# EAGLE design RGBLedDimmer (EAGLE 6.4)
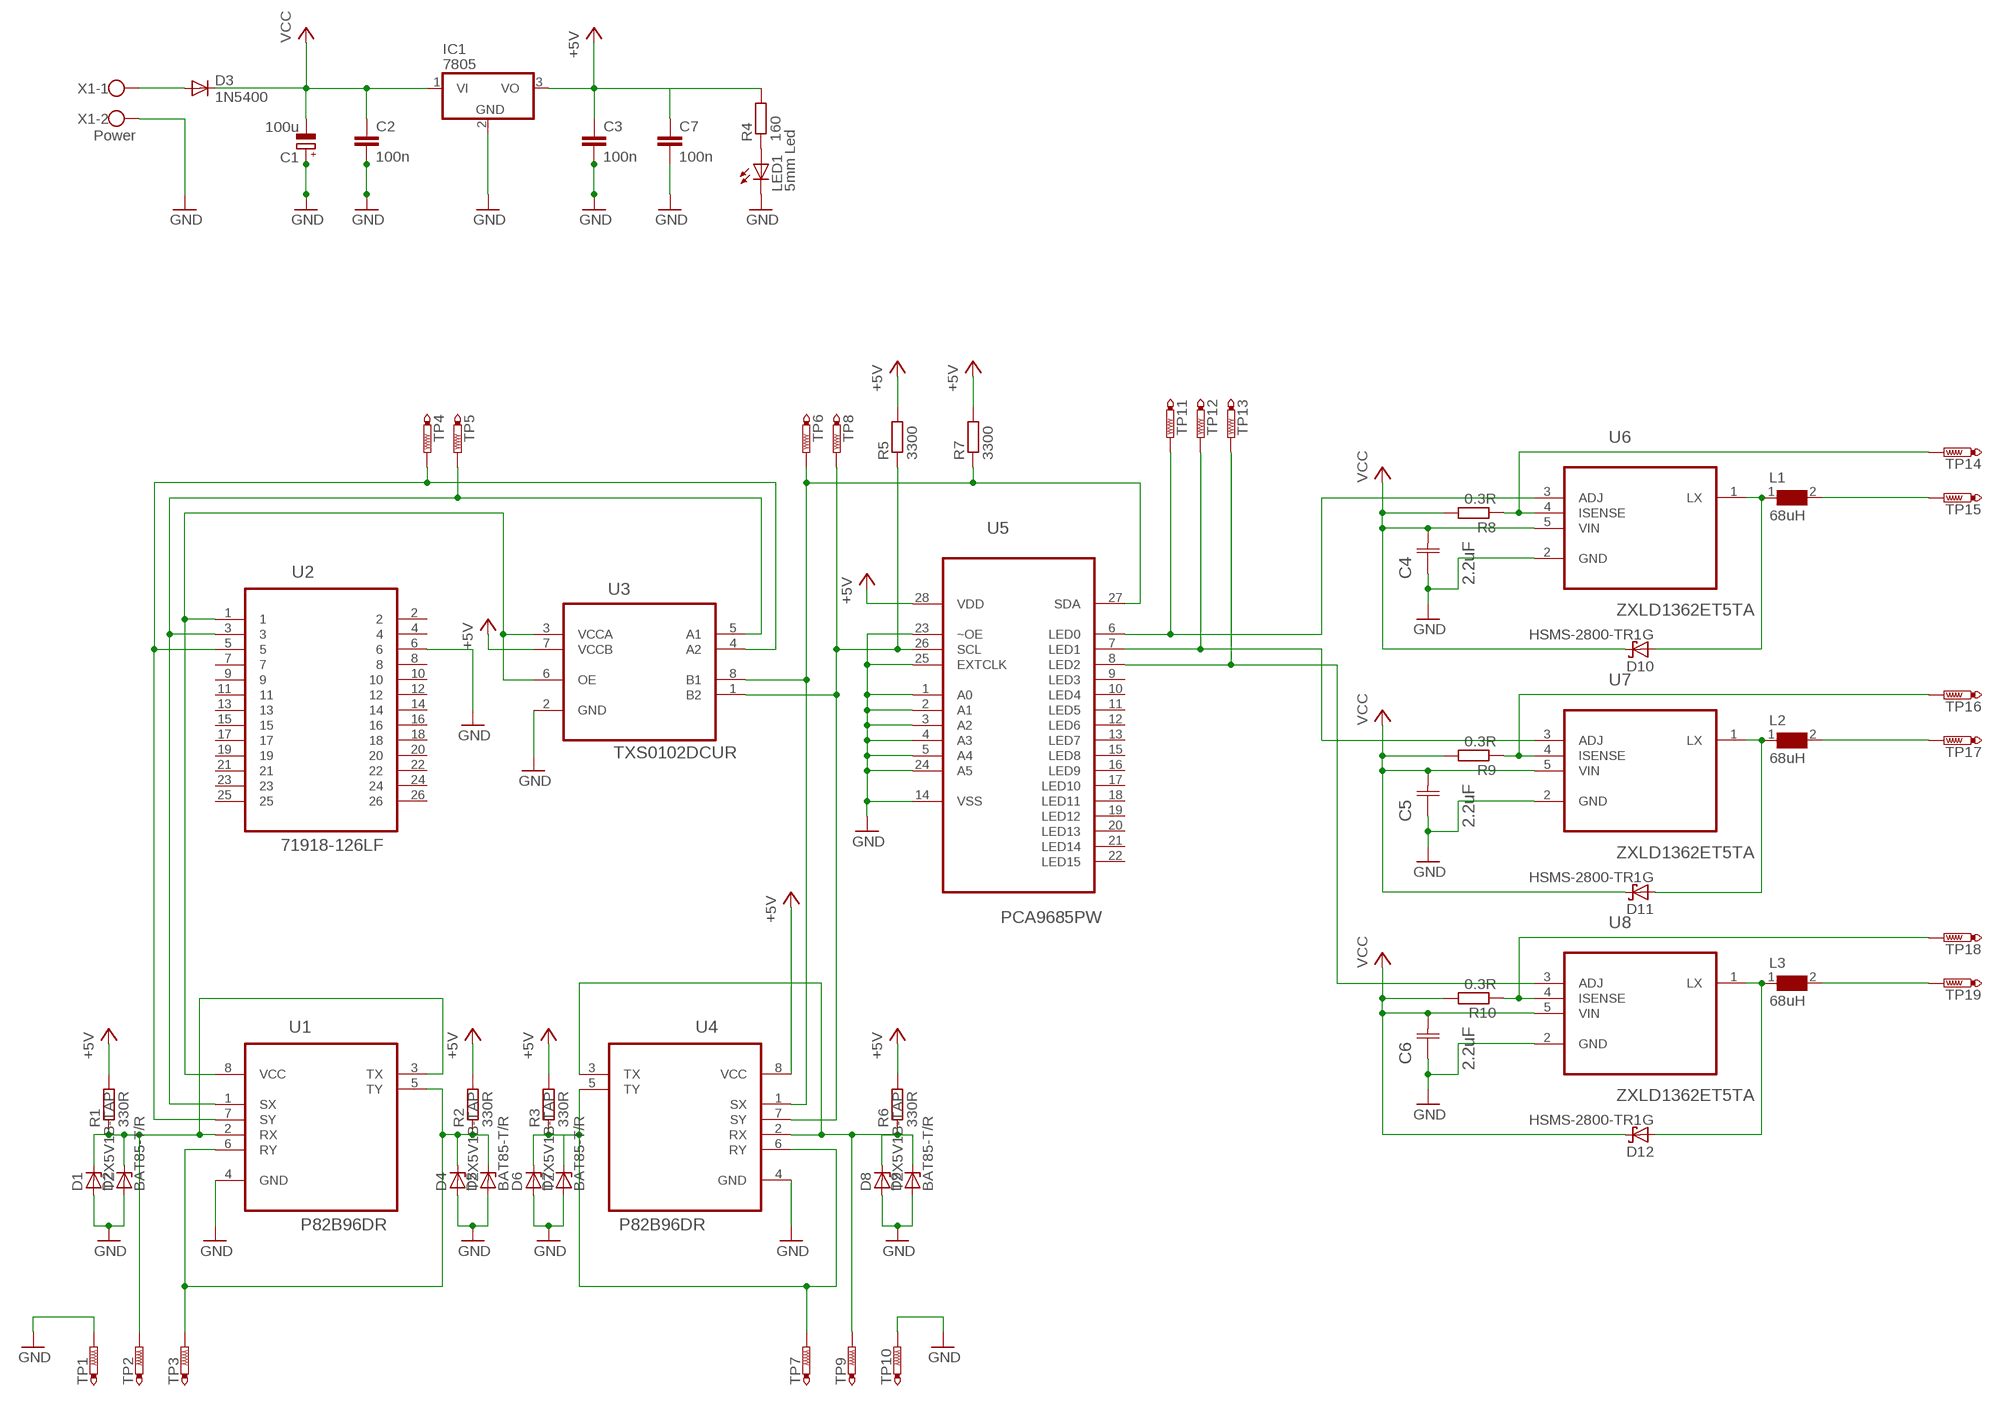
[diagram p0: schematic, sheet 1]

## Parts
C1  100u  CPOL-EUE3.5-8  [E3,5-8]
C2  100n  C-EU025_050-025X075  [C025_050-025X075]
C3  100n  C-EU025_050-025X075  [C025_050-025X075]
C4  2.2uF  08053C225KAT2A  [CAPC2013X152N]
C5  2.2uF  08053C225KAT2A  [CAPC2013X152N]
C6  2.2uF  08053C225KAT2A  [CAPC2013X152N]
C7  100n  C-EU025_050-025X075  [C025_050-025X075]
D1  TZX5V1B-TAP  ZENER-DIODEDO34-7  [DO34Z7]
D2  BAT85-T/R  ZENER-DIODEDO34-7  [DO34Z7]
D3  1N5400  [DO201-15]
D4  TZX5V1B-TAP  ZENER-DIODEDO34-7  [DO34Z7]
D5  BAT85-T/R  ZENER-DIODEDO34-7  [DO34Z7]
D6  TZX5V1B-TAP  ZENER-DIODEDO34-7  [DO34Z7]
D7  BAT85-T/R  ZENER-DIODEDO34-7  [DO34Z7]
D8  TZX5V1B-TAP  ZENER-DIODEDO34-7  [DO34Z7]
D9  BAT85-T/R  ZENER-DIODEDO34-7  [DO34Z7]
D10  HSMS-2800-TR1G  BAS70  [SOT23]
D11  HSMS-2800-TR1G  BAS70  [SOT23]
D12  HSMS-2800-TR1G  BAS70  [SOT23]
IC1  7805  7812TV  [TO220V]
L1  68uH  WE-PD4-74456168_L  [L]
L2  68uH  WE-PD4-74456168_L  [L]
L3  68uH  WE-PD4-74456168_L  [L]
LED1  5mm Led  LED5MM  [LED5MM]
R1  330R  R-EU_0204/7  [0204/7]
R2  330R  R-EU_0204/7  [0204/7]
R3  330R  R-EU_0204/7  [0204/7]
R4  160  R-EU_0204/7  [0204/7]
R5  3300  R-EU_0204/7  [0204/7]
R6  330R  R-EU_0204/7  [0204/7]
R7  3300  R-EU_0204/7  [0204/7]
R8  0.3R  R-EU_R0603  [R0603]
R9  0.3R  R-EU_R0603  [R0603]
R10  0.3R  R-EU_R0603  [R0603]
TP1  PTR1PAD1-13  [P1-13]
TP2  PTR1PAD1-13  [P1-13]
TP3  PTR1PAD1-13  [P1-13]
TP4  PTR1PAD1-13  [P1-13]
TP5  PTR1PAD1-13  [P1-13]
TP6  PTR1PAD1-13  [P1-13]
TP7  PTR1PAD1-13  [P1-13]
TP8  PTR1PAD1-13  [P1-13]
TP9  PTR1PAD1-13  [P1-13]
TP10  PTR1PAD1-13  [P1-13]
TP11  PTR1PAD1-13  [P1-13]
TP12  PTR1PAD1-13  [P1-13]
TP13  PTR1PAD1-13  [P1-13]
TP14  PTR1PAD1-13  [P1-13]
TP15  PTR1PAD1-13  [P1-13]
TP16  PTR1PAD1-13  [P1-13]
TP17  PTR1PAD1-13  [P1-13]
TP18  PTR1PAD1-13  [P1-13]
TP19  PTR1PAD1-13  [P1-13]
U1  P82B96DR  [SOIC127P600X175-8N]
U2  71918-126LF  [FCI_71918-126LF]
U3  TXS0102DCUR  [SOP50P310X90-8N]
U4  P82B96DR  [SOIC127P600X175-8N]
U5  PCA9685PW  [SOP65P640X110-28N]
U6  ZXLD1362ET5TA  [SOT95P270X145-5N]
U7  ZXLD1362ET5TA  [SOT95P270X145-5N]
U8  ZXLD1362ET5TA  [SOT95P270X145-5N]
X1  Power  W237-102  [W237-102]

## Nets
+5V [Normal Bcc]: C3.1 C7.1 IC1.3(VO) R1.2 R2.2 R3.2 R4.2 R5.2 R6.2 R7.2 U3.7(VCCB) U4.8(VCC) U5.28(VDD)
GND: C1.+ C2.2 C3.2 C4.1(C1) C5.1(C1) C6.1(C1) C7.2 D1.A D2.A D4.A D5.A D6.A D7.A D8.A D9.A IC1.2(GND) LED1.K(C) TP1.TP TP10.TP U1.4(GND) U2.6 U3.2(GND) U4.4(GND) U5.1(A0) U5.2(A1) U5.3(A2) U5.4(A3) U5.5(A4) U5.14(VSS) U5.23(~OE) U5.24(A5) U5.25(EXTCLK) U6.2(GND) U7.2(GND) U8.2(GND) X1.2
N$1 [LED Current]: R8.1 TP14.TP U6.4(ISENSE)
N$2: TP12.TP U5.7(LED1) U7.3(ADJ)
N$3: R7.1 TP6.TP U3.8(B1) U4.1(SX) U5.27(SDA)
N$4 [LED Current]: R9.1 TP16.TP U7.4(ISENSE)
N$5 [LED Current]: L2.2 TP17.TP
N$6 [LED Current]: L1.2 TP15.TP
N$7: U1.8(VCC) U2.1 U3.3(VCCA) U3.6(OE)
N$8: TP11.TP U5.6(LED0) U6.3(ADJ)
N$9 [LED Current]: D11.1(A) L2.1 U7.1(LX)
N$10 [LED Current]: D10.1(A) L1.1 U6.1(LX)
N$11 [Big Vcc]: D3.A X1.1
N$12: R5.1 TP8.TP U3.1(B2) U4.7(SY) U5.26(SCL)
N$13: TP5.TP U1.1(SX) U2.3 U3.5(A1)
N$14: TP4.TP U1.7(SY) U2.5 U3.4(A2)
N$15: TP13.TP U5.8(LED2) U8.3(ADJ)
N$16 [LED Current]: R10.1 TP18.TP U8.4(ISENSE)
N$17: D8.C D9.C R6.1 TP9.TP U4.2(RX) U4.3(TX)
N$18 [LED Current]: L3.2 TP19.TP
N$19 [LED Current]: D12.1(A) L3.1 U8.1(LX)
N$20: D1.C D2.C R1.1 TP2.TP U1.2(RX) U1.3(TX)
N$21: D4.C D5.C R2.1 TP3.TP U1.5(TY) U1.6(RY)
N$22: D6.C D7.C R3.1 TP7.TP U4.5(TY) U4.6(RY)
N$39: LED1.A R4.1
VCC [Big Vcc]: C1.- C2.1 C4.2(C2) C5.2(C2) C6.2(C2) D3.C D10.3(C) D11.3(C) D12.3(C) IC1.1(VI) R8.2 R9.2 R10.2 U6.5(VIN) U7.5(VIN) U8.5(VIN)
Unconnected: U2.2 U2.4 U2.7 U2.8 U2.9 U2.10 U2.11 U2.12 U2.13 U2.14 U2.15 U2.16 U2.17 U2.18 U2.19 U2.20 U2.21 U2.22 U2.23 U2.24 U2.25 U2.26 U5.9(LED3) U5.10(LED4) U5.11(LED5) U5.12(LED6) U5.13(LED7) U5.15(LED8) U5.16(LED9) U5.17(LED10) U5.18(LED11) U5.19(LED12) U5.20(LED13) U5.21(LED14) U5.22(LED15)

## Library data of the parts
C1 = rcl:CPOL-EU: POLARIZED CAPACITOR, European symbol
C2 C3 C7 = rcl:C-EU: CAPACITOR, European symbol
C4-C6 = AVX_By_element14_Batch_1:08053C225KAT2A: Capacitor 0805; MPN: 08053C225KAT2A; OC_FARNELL: 1657931; OC_NEWARK: 10R5975; SUPPLIER: AVX; TOLERANCE: ±10%; VOLTAGERATING: 25V
D1 D2 D4-D9 = diode:ZENER-DIODE: Z-Diode
D3 = diode:1N5400: DIODE standard rectifier, 3 A, 50 V (Motorola)
D10-D12 = diode:BAS70: Silicon Schottky Diodes General-purpose diode for high-speed switching
IC1 = linear:78*: Positive VOLTAGE REGULATOR Source: http://cache.national.com/ds/LM/LM78L05.pdf http://www.fairchildsemi.com/ds/LM/LM7805.pdf
L1-L3 = WE-PD4:WE-PD4: SMD-Power Inductors WE-PD4 - Current loading up to 35 A - Compact size - Low-loss ferrite core - High storage capacity - Industry standardized size - Application frequency range up to 10 MHz -- Is recommended for the application with switching regulators from National Semiconductor, Linear Technology, Texas Instruments and Fairchild Semiconductor -- Noise suppression -- Perfectly suitable for switching regulators with extremely high efficiency; MPN: 74456168; OC_FARNELL: 1636136; OC_NEWARK: 08P2689; PACKAGE: Type_L; SUPPLIER: Wuerth Elektronik
LED1 = led:LED: LED OSRAM: - CHIPLED LG R971, LG N971, LY N971, LG Q971, LY Q971, LO R971, LY R971 LH N974, LH R974 LS Q976, LO Q976, LY Q976 LO Q996 - Hyper CHIPLED LW Q18S LB Q993, LB Q99A, LB R99A - SideLED LS A670, LO A670, LY A670, LG A670, LP A670 LB A673, LV A673, LT A673, LW A673 LH A674 LY A675 LS A676, LA A676, LO A676, LY A676, LW A676 LS A679, LY A679, LG A679 - Hyper Micro SIDELED® LS Y876, LA Y876, LO Y876, LY Y876 LT Y87S - SmartLED LW L88C, LW L88S LB L89C, LB L89S, LG L890 LS L89K, LO L89K, LY L89K LS L896, LA L896, LO L896, LY L896 - TOPLED LS T670, LO T670, LY T670, LG T670, LP T670 LSG T670, LSP T670, LSY T670, LOP T670, LYG T670 LG T671, LOG T671, LSG T671 LB T673, LV T673, LT T673, LW T673 LH T674 LS T676, LA T676, LO T676, LY T676, LB T676, LH T676, LSB T676, LW T676 LB T67C, LV T67C, LT T67C, LS T67K, LO T67K, LY T67K, LW E67C LS E67B, LA E67B, LO E67B, LY E67B, LB E67C, LV E67C, LT E67C LW T67C LS T679, LY T679, LG T679 LS T770, LO T770, LY T770, LG T770, LP T770 LB T773, LV T773, LT T773, LW T773 LH T774 LS E675, LA E675, LY E675, LS T675 LS T776, LA T776, LO T776, LY T776, LB T776 LHGB T686 LT T68C, LB T68C - Hyper Mini TOPLED® LB M676 - Mini TOPLED Santana® LG M470 LS M47K, LO M47K, LY M47K Source: http://www.osram.convergy.de LUXEON: - LUMILED® LXK2-PW12-R00, LXK2-PW12-S00, LXK2-PW14-U00, LXK2-PW14-V00 LXK2-PM12-R00, LXK2-PM12-S00, LXK2-PM14-U00 LXK2-PE12-Q00, LXK2-PE12-R00, LXK2-PE12-S00, LXK2-PE14-T00, LXK2-PE14-U00 LXK2-PB12-K00, LXK2-PB12-L00, LXK2-PB12-M00, LXK2-PB14-N00, LXK2-PB14-P00, LXK2-PB14-Q00 LXK2-PR12-L00, LXK2-PR12-M00, LXK2-PR14-Q00, LXK2-PR14-R00 LXK2-PD12-Q00, LXK2-PD12-R00, LXK2-PD12-S00 LXK2-PH12-R00, LXK2-PH12-S00 LXK2-PL12-P00, LXK2-PL12-Q00, LXK2-PL12-R00 Source: www.luxeon.com KINGBRIGHT: KA-3528ASYC Source: www.kingbright.com
R1-R7 = rcl:R-EU_: RESISTOR, European symbol
R8-R10 = resistor:R-EU_: RESISTOR, European symbol
TP1-TP19 = testpad:PTR1: TEST PIN
U1 U4 = Texas:P82B96DR: DUAL BIDIRECTIONAL BUS BUFFER; MPN: P82B96DR; OC_FARNELL: 1576671; OC_NEWARK: 88K6385; PACKAGE: SOIC-8; SUPPLIER: Texas Instruments
U2 = Fci:71918-126LF: LATCH HEADER, STRAIGHT; MPN: 71918-126LF; OC_FARNELL: 1103941; OC_NEWARK: 62K7328; PACKAGE: CON-26WAYS; SUPPLIER: FCI
U3 = Texas:TXS0102DCUR: 2-BIT BIDIRECTIONAL VOLTAGE-LEVEL TRANSLATOR FOR OPEN-DRAIN AND PUSH-PULL APPLICATIONS; MPN: TXS0102DCUR; OC_FARNELL: 1703315; OC_NEWARK: 30M1878; PACKAGE: SOP-8; SUPPLIER: Texas Instruments
U5 = NXP_By_element14_Batch_1:PCA9685PW: 16-channel, 12-bit PWM Fm+ I2C-bus LED controller; MPN: PCA9685PW; OC_FARNELL: 1854074; OC_NEWARK: 19T6398; PACKAGE: TSSOP-28; SUPPLIER: NXP
U6-U8 = ZEtex:ZXLD1362ET5TA: 60V 1A LED DRIVER WITH AEC-Q100; MPN: ZXLD1362ET5TA; OC_FARNELL: 1843876; OC_NEWARK: 12T2272; PACKAGE: SOT-5; SUPPLIER: DIODES INC.
X1 = con-wago-500:W237-102: WAGO SCREW CLAMP; MPN: 237-102; OC_FARNELL: unknown; OC_NEWARK: 70K9898

## Net classes
0 default: width 0.2 mm, clearance 0.2 mm
1 Normal Bcc: width 0.152 mm, clearance 0.2 mm
2 Big Vcc: width 0.762 mm, clearance 0.2 mm
3 LED Current: width 0.152 mm, clearance 0.2 mm

## Board
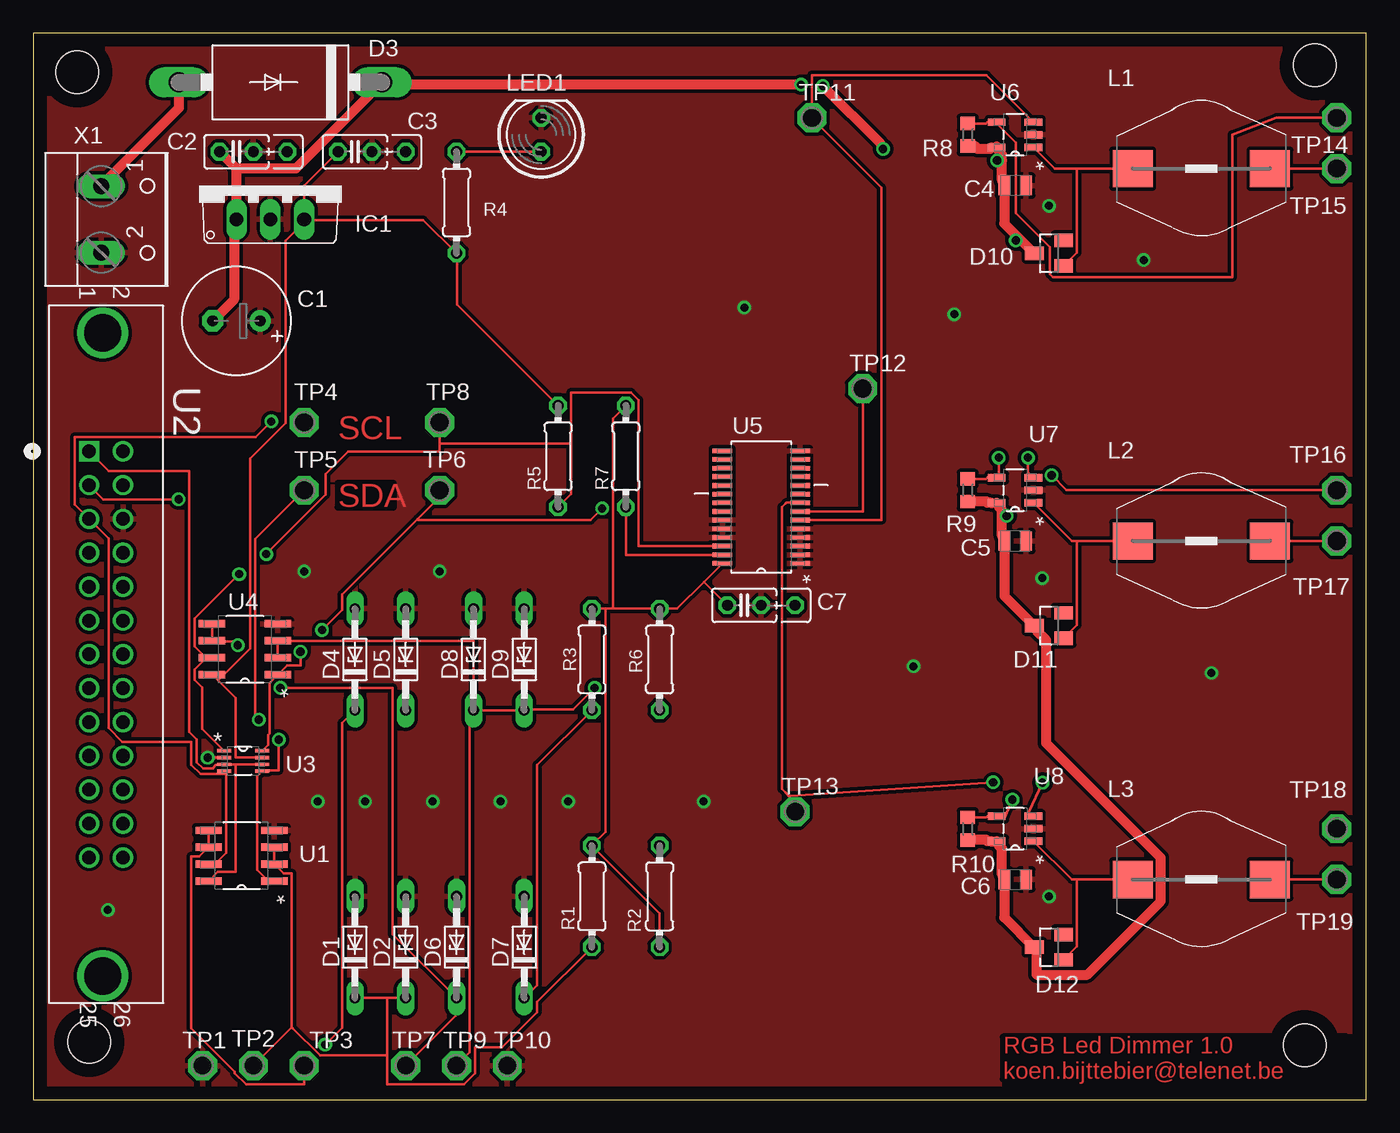
[diagram p1: board, top side]
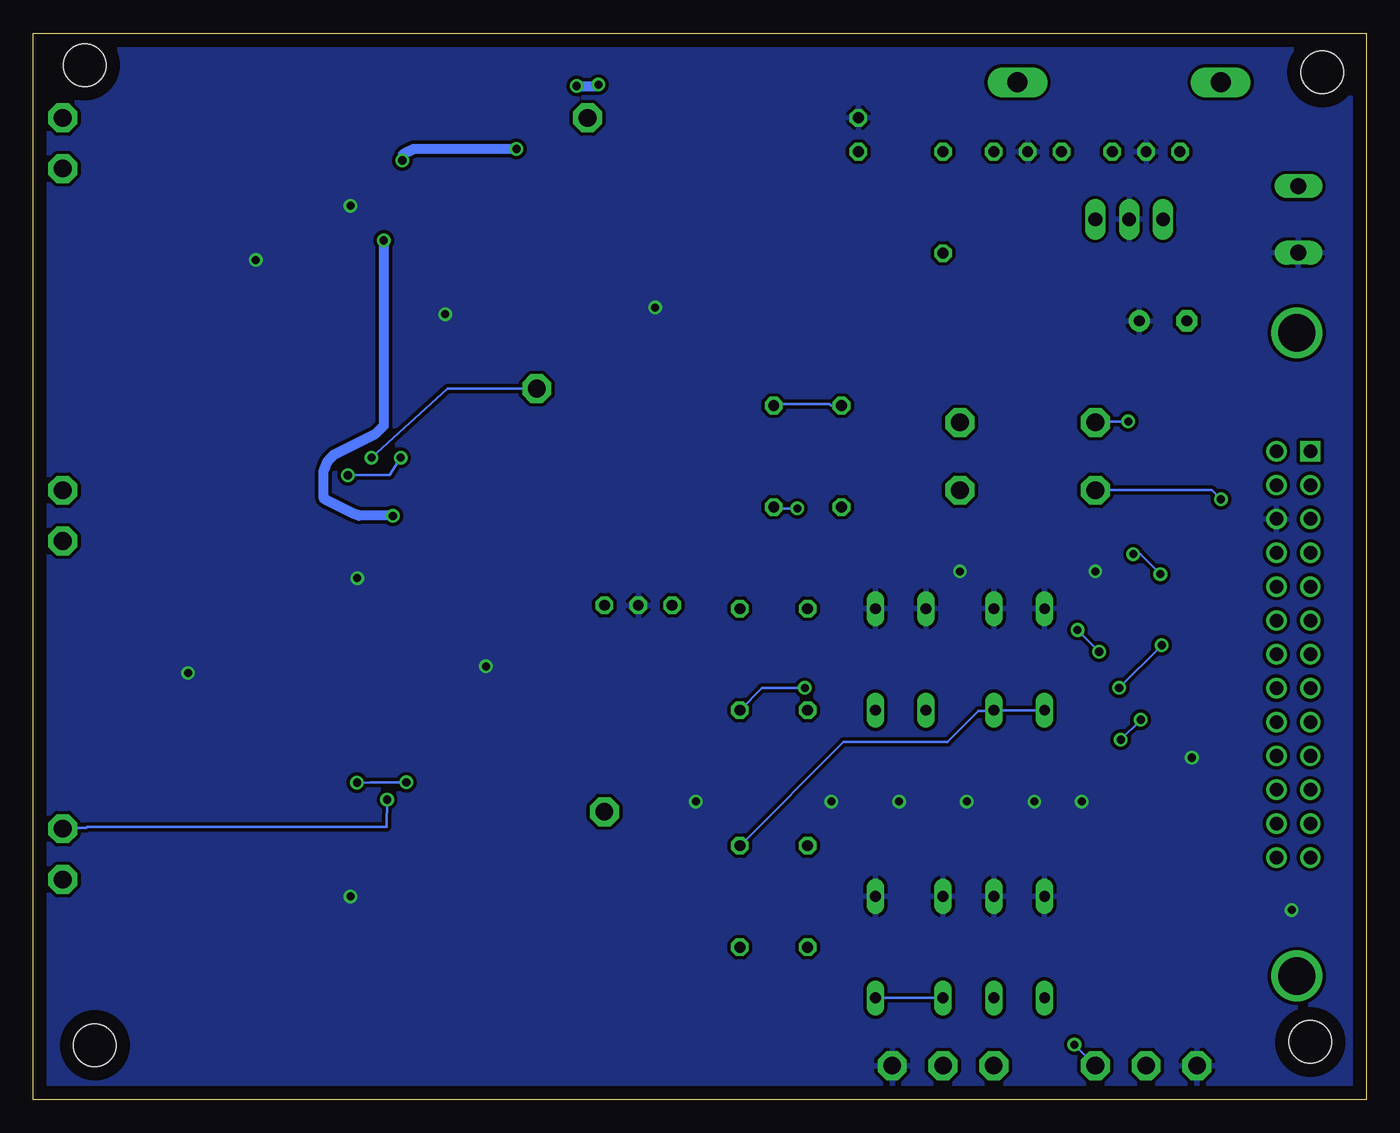
[diagram p2: board, bottom side, seen from below]

Size 100 x 80 mm. Coordinates in mm from the lower left corner, seen from the top.
Outline: 0,0 100,0 100,80 0,80 0,0
Copper layers (1*16): Top 0.035mm / dielectric 1.5mm / Bottom 0.035mm
Design rules "default *": minimum track width 0.2mm, minimum drill 24mil, track to track 8mil, track to pad 8mil, pad to pad 8mil, via to via 8mil, smd to smd 8mil, copper to edge 40mil, drill to drill 8mil, minimum pad ring 10mil, minimum via ring 8mil, stop-mask expansion 4mil, vias tented up to drill 0mil, thermal gap 10mil
Holes 3.2 mm at 4.19,4.32 95.38,4.06 96.14,77.6 3.3,77.09

### Footprints (pad centres in the part's own frame; a part is rotated, then mirrored left to right if it is on the bottom)
E3,5-8 = drill 0.813 pad 1.6: + -1.778,0 | drill 0.813 pad 1.6 octagon: - 1.778,0
C025_050-025X075 = drill 0.813 octagon: 1 -1.27,0; 2 1.27,0; 3 3.81,0
CAPC2013X152N = smd 0.914 x 1.448: 1 -0.813,0; 2 0.813,0
DO34Z7 = drill 0.813 long: A 3.81,0; C -3.81,0
DO201-15 = drill 1.499 long: A 7.62,0; C -7.62,0
SOT23 = smd 1 x 1.4: 1 -0.95,-1.1; 2 0.95,-1.1; 3 0,1.1
TO220V = drill 1.016 long: 1 -2.54,-2.54; 2 0,-2.54; 3 2.54,-2.54
L = smd 3 x 2.8: 1 -5.15,0; 2 5.15,0
LED5MM = drill 0.813 octagon: A -1.27,0; K 1.27,0
0204/7 = drill 0.813 octagon: 1 -3.81,0; 2 3.81,0
R0603 = smd 1 x 1.1: 1 -0.85,0; 2 0.85,0
P1-13 = drill 1.321 pad 2.159 octagon: TP 0,0
SOIC127P600X175-8N = smd 1.981 x 0.559: 1 -2.464,1.905; 2 -2.464,0.635; 3 -2.464,-0.635; 4 -2.464,-1.905; 5 2.464,-1.905; 6 2.464,-0.635; 7 2.464,0.635; 8 2.464,1.905
FCI_71918-126LF = drill 1.016 square: 1 -30.48,-2.54 | drill 1.016: 2 -30.48,0; 3 -27.94,-2.54; 4 -27.94,0; 5 -25.4,-2.54; 6 -25.4,0; 7 -22.86,-2.54; 8 -22.86,0; 9 -20.32,-2.54; 10 -20.32,0; 11 -17.78,-2.54; 12 -17.78,0; 13 -15.24,-2.54; 14 -15.24,0; 15 -12.7,-2.54; 16 -12.7,0; 17 -10.16,-2.54; 18 -10.16,0; 19 -7.62,-2.54; 20 -7.62,0; 21 -5.08,-2.54; 22 -5.08,0; 23 -2.54,-2.54; 24 -2.54,0; 25 0,-2.54; 26 0,0 | drill 2.794: 27 -39.37,-1.524; 28 8.89,-1.524
SOP50P310X90-8N = smd 1.067 x 0.254: 1 -1.422,0.762; 2 -1.422,0.254; 3 -1.422,-0.254; 4 -1.422,-0.762; 5 1.422,-0.762; 6 1.422,-0.254; 7 1.422,0.254; 8 1.422,0.762
SOP65P640X110-28N = smd 1.473 x 0.356: 1 -2.921,4.216; 2 -2.921,3.581; 3 -2.921,2.921; 4 -2.921,2.286; 5 -2.921,1.626; 6 -2.921,0.965; 7 -2.921,0.33; 8 -2.921,-0.33; 9 -2.921,-0.965; 10 -2.921,-1.626; 11 -2.921,-2.286; 12 -2.921,-2.921; 13 -2.921,-3.581; 14 -2.921,-4.216; 15 2.921,-4.216; 16 2.921,-3.581; 17 2.921,-2.921; 18 2.921,-2.286; 19 2.921,-1.626; 20 2.921,-0.965; 21 2.921,-0.33; 22 2.921,0.33; 23 2.921,0.965; 24 2.921,1.626; 25 2.921,2.286; 26 2.921,2.921; 27 2.921,3.581; 28 2.921,4.216
SOT95P270X145-5N = smd 1.321 x 0.559: 1 -1.372,0.94; 2 -1.372,0; 3 -1.372,-0.94; 4 1.372,-0.94; 5 1.372,0.94
W237-102 = drill 1.194 long: 1 -2.5,-1.27; 2 2.5,-1.27

### Placement (x,y rotation side)
C1  15.24,58.42 180 top
C2  15.24,71.12 0 top
C3  24.13,71.12 0 top
C4  73.66,68.58 180 top
C5  73.66,41.91 180 top
C6  73.66,16.51 180 top
C7  53.34,37.08 0 top
D1  24.13,11.43 90 top
D2  27.94,11.43 90 top
D3  18.54,76.33 180 top
D4  24.13,33.02 90 top
D5  27.94,33.02 90 top
D6  31.75,11.43 90 top
D7  36.83,11.43 90 top
D8  33.02,33.02 90 top
D9  36.83,33.02 90 top
D10  76.2,63.5 90 top
D11  76.2,35.56 90 top
D12  76.2,11.43 90 top
IC1  17.78,68.58 0 top
L1  87.63,69.85 0 top
L2  87.63,41.91 0 top
L3  87.63,16.51 0 top
LED1  38.1,72.39 90 top
R1  41.91,15.24 90 top
R2  46.99,15.24 270 top
R3  41.91,33.02 90 top
R4  31.75,67.31 270 top
R5  39.37,48.26 90 top
R6  46.99,33.02 90 top
R7  44.45,48.26 90 top
R8  70.1,72.39 270 top
R9  70.1,45.72 270 top
R10  70.1,20.32 270 top
TP1  12.7,2.54 0 top
TP2  16.51,2.54 0 top
TP3  20.32,2.54 0 top
TP4  20.32,50.8 0 top
TP5  20.32,45.72 0 top
TP6  30.48,45.72 0 top
TP7  27.94,2.54 0 top
TP8  30.48,50.8 0 top
TP9  31.75,2.54 0 top
TP10  35.56,2.54 0 top
TP11  58.42,73.66 0 top
TP12  62.23,53.34 0 top
TP13  57.15,21.59 0 top
TP14  97.79,73.66 0 top
TP15  97.79,69.85 0 top
TP16  97.79,45.72 0 top
TP17  97.79,41.91 0 top
TP18  97.79,20.32 0 top
TP19  97.79,16.51 0 top
U1  15.62,18.29 180 top
U2  6.73,18.16 270 top
U3  15.75,25.4 0 top
U4  15.88,33.78 180 top
U5  54.61,44.45 180 top
U6  73.66,72.39 180 top
U7  73.66,45.72 180 top
U8  73.66,20.32 180 top
X1  6.35,66.04 270 top

### Tracks (layer width: path | path; a pad name or v marks a point on that pad's centre or on a via)
+5V
  Top 0.2: R2.2 46.99,13.97 R1.2 41.96,19.13 42.93,20.09 42.93,36.83 | 50.3,38.85 48.28,36.83 R6.2 43.48,36.83 | 50.3,38.85 U5.28 | 43.48,36.83 42.93,36.83 | 42.93,36.83 R3.2 | R7.2 43.48,51.1 43.48,36.83 | U3.7 15.16,25.65 15.16,30.12 13.86,31.43 | U4.8 13.86,31.43 | C3.1 20.32,68.58 IC1.3 | IC1.3 20.4,65.99 29.26,65.99 R4.2 31.8,63.42 31.8,59.64 R5.2 | 13.86,31.43 16.26,33.83 16.26,48.11 18.92,50.77 18.92,64.44 20.37,65.89 IC1.3 | 50.3,38.85 C7.1
  Bottom 0.2: R7.2 44.35,52.17 40.26,52.17 40.16,52.07 R5.2
GND  (via drill 0.6, 0.61)
  Top 0.2: v13.08,25.65 U3.2
  other vias: 20.32,39.62 30.48,39.62 21.34,22.35 24.89,22.35 29.97,22.35 35.05,22.35 40.13,22.35 50.29,22.35 53.34,59.44 69.09,58.93 83.31,62.99 75.69,39.12 66.04,32.51 88.39,32 76.2,15.24 5.59,14.22 76.2,67.06
  pour Bottom (isolate 0.254): 0,80.01 100.33,80.01 100.33,0 0,0
  pour Top (isolate 0.254): 0,80.01 100.33,80.01 100.33,0 0,0
N$1
  Top 0.2: U6.4 72.29,73.25 | TP14.TP 93.24,73.66 89.94,72.39 89.94,61.72 76.48,61.72 76.28,61.92 76.28,63.96 73.71,66.52 73.71,71.81 72.34,73.18 U6.4 | U6.4 71.58,73.33 71.48,73.23 70.1,73.23 R8.1
N$2  (via drill 0.61)
  Top 0.2: U7.3 74.62,47.07 v74.62,48.16 | U5.7 62.23,44.12 TP12.TP
  Bottom 0.2: v74.62,48.16 68.94,53.34 TP12.TP
N$3  (via drill 0.61)
  Top 0.2: U5.27 44.45,40.87 R7.1 | U3.8 17.6,26.59 17.6,27.36 17.73,27.48 17.73,31.27 U4.1 18.41,31.93 19.05,32.56 20.04,32.56 v20.04,33.6 | v21.67,35.23 23.16,36.73 23.16,37.9 28.82,43.55 | 28.82,43.55 30.48,45.21 TP6.TP | v42.67,44.35 41.81,43.48 28.88,43.48 28.82,43.55
  Bottom 0.2: v21.67,35.23 v20.04,33.6 | R7.1 44.35,44.35 v42.67,44.35
N$4  (via drill 0.61)
  Top 0.2: U7.4 72.29,46.58 | v72.44,48.16 72.44,46.84 72.34,46.74 U7.4 | v76.4,46.84 77.52,45.72 TP16.TP | U7.4 71.58,46.66 71.48,46.56 70.1,46.56 R9.1
  Bottom 0.2: v72.44,48.16 73.25,46.84 v76.4,46.84
N$5
  Top 0.2: TP17.TP L2.2
N$6
  Top 0.2: TP15.TP L1.2
N$7
  Top 0.2: U3.6 15.16,25.15 | 15.16,25.15 U3.3 14.25,25.09 13.69,25.09 13.49,24.89 13.49,24.84 12.72,24.84 12.27,25.3 12.27,27.03 11.71,27.58 11.71,47.17 5.66,47.17 U2.1 | U1.8 13.84,17.07 15.16,17.07 15.16,25.15
N$8
  Top 0.2: U6.3 71.5,76.86 58.42,76.86 TP11.TP 58.47,73.58 63.63,68.43 63.63,43.48 U5.6
N$9
  Top 0.2: U7.1 77.9,41.91 78.31,41.91 | L2.1 78.31,41.91 | 78.31,41.91 78.31,35.61 77.32,34.62 D11.1
N$10
  Top 0.2: U6.1 76.63,69.85 78.31,69.85 | L1.1 78.31,69.85 | 78.31,69.85 78.31,63.55 77.32,62.56 D10.1
N$11
  Top 0.762: D3.A 10.92,74.4 5.08,68.56 X1.1
N$12  (via drill 0.61)
  Top 0.2: U5.26 45.41,41.53 45.41,52.48 44.86,53.03 40.34,53.03 40.34,49.23 | 40.34,49.23 40.34,45.41 R5.1 | U3.1 12.68,27.81 12.68,30.91 12.12,31.47 12.12,32.28 12.98,33.15 U4.7 12.9,33.2 12.12,33.98 12.12,36.09 v15.44,39.42 | v17.48,40.92 21.95,45.39 21.95,46.94 23.62,48.62 30.48,48.62 30.48,49.23 | TP8.TP 30.48,49.23 | 30.48,49.23 40.34,49.23
  Bottom 0.2: v15.44,39.42 16.94,40.92 v17.48,40.92
N$13  (via drill 0.61)
  Top 0.2: U1.1 17.65,16.38 16.79,17.25 16.79,24.26 U3.5 17.25,24.69 18.41,24.69 v18.41,27 | U2.3 5.26,45.03 v10.9,45.03 | v16.92,28.5 16.66,28.75 16.66,42.06 TP5.TP
  Bottom 0.2: v10.9,45.03 11.58,45.72 TP5.TP | v16.92,28.5 v18.41,27
N$14  (via drill 0.61)
  Top 0.2: U3.4 14.45,24.51 14.45,24.43 | 14.45,24.43 14.45,18.52 13.59,17.65 U1.7 | 14.45,24.43 12.55,24.43 11.86,25.12 11.86,26.85 6.68,26.85 5.66,27.86 5.66,42.09 U2.5 4.14,43.64 3.12,44.65 3.12,49.71 16.69,49.71 v17.86,50.88
  Bottom 0.2: TP4.TP 20.24,50.88 v17.86,50.88
N$15  (via drill 0.61)
  Top 0.2: U8.3 74.7,21.59 v75.72,23.77 | 57.15,22.28 TP13.TP 57.1,22.35 56.73,22.72 | U5.8 56.49,44.78 56.44,44.7 56.19,44.45 56.19,23.29 56.44,23.04 56.49,22.96 56.73,22.72 | v72.01,23.8 56.79,22.78 56.73,22.72
  Bottom 0.2: v75.72,23.77 74.68,23.8 v72.01,23.8
N$16  (via drill 0.61)
  Top 0.2: R10.1 70.1,21.16 71.48,21.16 71.58,21.26 U8.4 72.85,21.26 72.85,21.08 v73.46,22.5
  Bottom 0.2: v73.46,22.5 73.48,20.45 95.96,20.45 95.99,20.42 96.01,20.42 96.04,20.4 97.05,20.4 97.08,20.37 97.08,20.32 TP18.TP
N$17  (via drill 0.61)
  Top 0.2: U4.2 U4.3 33.02,34.42 D8.C | D8.C D9.C 36.91,29.26 40.49,29.26 v42.11,30.89 | TP9.TP 32.74,3.53 32.74,28.91 32.97,29.13 D8.C
  Bottom 0.2: R6.1 45.31,30.89 v42.11,30.89
N$18
  Top 0.2: TP19.TP L3.2
N$19
  Top 0.2: U8.1 77.9,16.51 78.31,16.51 | L3.1 78.31,16.51 | 78.31,16.51 78.31,11.48 77.32,10.49 D12.1
N$20
  Top 0.2: U1.3 U1.2 18.16,17.6 18.8,16.97 19.38,16.97 19.38,5.41 | TP2.TP 19.38,5.41 | D2.C 26.54,7.62 | 26.54,7.62 D1.C | R1.1 37.8,7.32 37.8,6.55 35.18,3.94 33.15,3.94 33.15,1.98 32.31,1.14 26.54,1.14 26.54,3.3 | 26.54,7.62 26.54,3.3 | 26.54,3.3 21.51,3.3 19.46,5.36 19.38,5.41
N$21  (via drill 0.61)
  Top 0.2: U1.5 U1.6 13.08,18.87 12.45,18.24 11.86,18.24 11.86,5.33 15.11,2.08 15.11,1.98 15.95,1.14 20.32,1.14 TP3.TP | v21.89,4.12 23.16,5.38 23.16,28.25 D4.C
  Bottom 0.2: D4.C D5.C 28.02,29.16 29.08,29.16 31.42,26.82 39.22,26.82 R2.1 | v21.89,4.12 TP3.TP
N$22  (via drill 0.61)
  Top 0.2: U4.5 U4.6 13.49,34.37 15.34,34.37 v15.34,34.09 | v18.54,30.89 26.98,30.89 26.98,12.39 D6.C 31.7,7.54 31.7,6.3 TP7.TP | R3.1 37.8,25.09 37.8,8.59 D7.C
  Bottom 0.2: v18.54,30.89 v15.34,34.09 | D6.C D7.C
N$39
  Top 0.2: LED1.A R4.1
VCC  (via drill 0.61)
  Top 0.762: 15.24,69.85 C2.1 | 15.24,69.85 IC1.1 15.06,65.68 15.06,60.02 C1.- | 15.24,69.85 15.6,69.88 19.71,69.88 D3.C 26.52,76.15 v57.61,76.15 | U6.5 72.29,71.53 | 73.91,64.67 72.85,65.73 C4.2 72.67,68.94 72.67,70.46 | 73.91,64.67 75.08,63.5 D10.3 | 72.67,70.46 72.67,70.89 72.47,71.09 U6.5 | 72.67,43.79 72.67,42.27 C5.2 72.87,41.5 72.87,37.77 75.08,35.56 D11.3 75.26,35.2 76,34.47 76,26.72 84.58,18.14 84.58,14.88 79.07,9.37 75.26,9.37 75.26,11.07 D12.3 75.08,11.43 72.85,13.66 C6.2 72.67,16.87 72.67,18.82 72.47,19.02 U8.5 71.88,19.36 71.86,19.38 71.58,19.38 71.48,19.48 70.1,19.48 R10.2 | 72.67,43.79 72.67,44.22 72.47,44.42 U7.5 71.88,44.76 71.86,44.78 71.58,44.78 71.48,44.88 70.1,44.88 R9.2 | v59.23,76.05 63.58,71.7 63.75,71.35 v63.75,71.32 | R8.2 70.1,71.55 70.61,71.55 70.84,71.32 71.78,71.32 71.88,71.42 U6.5 | v72.31,70.46 72.67,70.46 | v73.71,64.47 73.91,64.67 | v73.03,43.79 72.67,43.79
  Bottom 0.762: v57.61,76.15 57.71,76.05 v59.23,76.05 | v72.31,70.46 72.29,70.46 72.26,70.48 72.26,70.92 72.24,70.94 72.21,70.94 72.19,70.97 72.16,70.97 72.14,70.99 72.11,70.99 72.08,71.02 72.06,71.02 72.03,71.04 72.01,71.04 71.98,71.07 71.96,71.07 71.93,71.09 71.91,71.09 71.88,71.12 71.86,71.12 71.83,71.14 71.81,71.14 71.78,71.17 71.75,71.17 71.73,71.2 71.7,71.2 71.68,71.22 71.65,71.22 71.63,71.25 71.6,71.25 71.58,71.27 71.55,71.27 71.53,71.3 71.5,71.3 71.48,71.32 v63.75,71.32 | v73.71,64.47 73.69,64.47 73.69,50.57 73.71,50.55 73.74,50.55 73.76,50.52 73.76,50.49 73.79,50.49 73.81,50.47 73.81,50.44 73.84,50.44 73.86,50.42 73.86,50.39 73.89,50.39 73.91,50.37 73.91,50.34 73.94,50.34 73.97,50.32 73.97,50.29 73.99,50.29 74.02,50.27 74.02,50.24 74.04,50.24 74.07,50.22 74.07,50.19 74.09,50.19 74.12,50.16 74.12,50.14 74.14,50.14 74.17,50.11 74.17,50.09 74.19,50.09 74.22,50.06 74.22,50.04 74.24,50.04 74.27,50.01 74.27,49.99 74.3,49.99 74.32,49.96 74.32,49.94 74.35,49.94 74.37,49.91 74.4,49.91 74.42,49.89 74.45,49.89 74.47,49.86 74.5,49.86 74.52,49.84 74.55,49.84 74.57,49.81 74.6,49.81 74.62,49.78 74.65,49.78 74.68,49.76 74.7,49.76 74.73,49.73 74.75,49.73 74.78,49.71 74.8,49.71 74.83,49.68 74.85,49.68 74.88,49.66 74.91,49.66 74.93,49.63 74.95,49.63 74.98,49.61 75.01,49.61 75.03,49.58 75.06,49.58 75.08,49.55 75.11,49.55 75.13,49.53 75.16,49.53 75.18,49.51 75.21,49.51 75.23,49.48 75.26,49.48 75.29,49.45 75.31,49.45 75.34,49.43 75.36,49.43 75.39,49.4 75.41,49.4 75.44,49.38 75.46,49.38 75.49,49.35 75.51,49.35 75.54,49.33 75.56,49.33 75.59,49.3 75.62,49.3 75.64,49.28 75.67,49.28 75.69,49.25 75.72,49.25 75.74,49.23 75.77,49.23 75.79,49.2 75.82,49.2 75.84,49.17 75.87,49.17 75.89,49.15 75.92,49.15 75.95,49.12 75.97,49.12 76,49.1 76.02,49.1 76.05,49.07 76.07,49.07 76.1,49.05 76.12,49.05 76.15,49.02 76.17,49.02 76.2,49 76.22,49 76.25,48.97 76.28,48.97 76.3,48.95 76.33,48.95 76.35,48.92 76.38,48.92 76.4,48.9 76.43,48.9 76.45,48.87 76.48,48.87 76.5,48.84 76.53,48.84 76.56,48.82 76.58,48.82 76.61,48.79 76.63,48.79 76.66,48.77 76.68,48.77 76.71,48.74 76.73,48.74 76.76,48.72 76.78,48.72 76.81,48.69 76.83,48.69 76.86,48.67 76.89,48.67 76.91,48.64 76.94,48.64 76.96,48.62 76.99,48.62 77.01,48.59 77.04,48.59 77.06,48.56 77.09,48.56 77.11,48.54 77.14,48.54 77.17,48.51 77.19,48.51 77.22,48.49 77.24,48.49 77.27,48.46 77.29,48.46 77.32,48.44 77.34,48.44 77.37,48.41 77.39,48.41 77.42,48.39 77.44,48.39 77.47,48.36 77.47,48.34 77.5,48.34 77.52,48.31 77.52,48.28 77.55,48.28 77.57,48.26 77.57,48.23 77.6,48.23 77.62,48.21 77.62,48.18 77.65,48.18 77.67,48.16 77.67,48.13 77.7,48.13 77.72,48.11 77.72,48.08 77.75,48.08 77.78,48.06 77.78,48.03 77.8,48.03 77.83,48.01 77.83,47.98 77.85,47.98 77.88,47.95 77.88,47.93 77.9,47.93 77.93,47.9 77.93,47.88 77.95,47.85 77.95,47.83 77.98,47.8 77.98,47.75 78,47.73 78,47.7 78.03,47.68 78.03,47.65 78.05,47.62 78.05,47.57 78.08,47.55 78.08,47.52 78.11,47.5 78.11,47.45 78.13,47.42 78.13,47.4 78.16,47.37 78.16,47.32 78.18,47.3 78.18,47.27 78.21,47.24 78.21,45.09 78.18,45.06 78.16,45.06 78.13,45.03 78.11,45.03 78.08,45.01 78.05,45.01 78.03,44.98 78,44.98 77.98,44.96 77.95,44.96 77.93,44.93 77.9,44.93 77.88,44.91 77.85,44.91 77.83,44.88 77.8,44.88 77.78,44.86 77.75,44.86 77.72,44.83 77.7,44.83 77.67,44.81 77.65,44.81 77.62,44.78 77.6,44.78 77.57,44.76 77.55,44.76 77.52,44.73 77.5,44.73 77.47,44.7 77.44,44.7 77.42,44.68 77.39,44.68 77.37,44.65 77.34,44.65 77.32,44.63 77.29,44.63 77.27,44.6 77.24,44.6 77.22,44.58 77.19,44.58 77.17,44.55 77.14,44.55 77.11,44.53 77.09,44.53 77.06,44.5 77.04,44.5 77.01,44.48 76.99,44.48 76.96,44.45 76.94,44.45 76.91,44.42 76.89,44.42 76.86,44.4 76.83,44.4 76.81,44.37 76.78,44.37 76.76,44.35 76.73,44.35 76.71,44.32 76.68,44.32 76.66,44.3 76.63,44.3 76.61,44.27 76.58,44.27 76.56,44.25 76.53,44.25 76.5,44.22 76.48,44.22 76.45,44.2 76.43,44.2 76.4,44.17 76.38,44.17 76.35,44.15 76.33,44.15 76.3,44.12 76.28,44.12 76.25,44.09 76.22,44.09 76.2,44.07 76.17,44.07 76.15,44.04 76.1,44.04 76.07,44.02 76.05,44.02 76.02,43.99 76,43.99 75.97,43.97 75.92,43.97 75.89,43.94 75.87,43.94 75.84,43.92 75.79,43.92 75.77,43.89 75.74,43.89 75.72,43.87 75.67,43.87 75.64,43.84 75.62,43.84 75.59,43.81 73.05,43.81 v73.03,43.79

### Text on the board
Top: SCL | SDA | RGB Led Dimmer 1.0 / koen.bijttebier@telenet.be